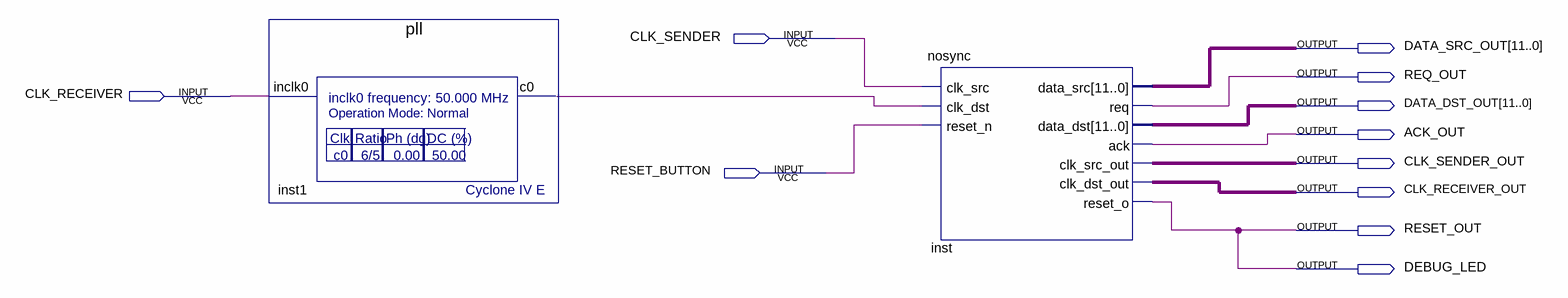
[diagram p0: schematic sheet]
// Quartus schematic no-sync_Top.bdf as structural Verilog: 2 symbols, 11 pins
module \no-sync_Top  (
  input  CLK_SENDER,
  input  CLK_RECEIVER,
  input  RESET_BUTTON,
  output [11:0] DATA_SRC_OUT,
  output REQ_OUT,
  output [11:0] DATA_DST_OUT,
  output ACK_OUT,
  output CLK_SENDER_OUT,
  output CLK_RECEIVER_OUT,
  output RESET_OUT,
  output DEBUG_LED
);

  wire inst1_c0;

  pll inst1 (.inclk0(CLK_RECEIVER), .c0(inst1_c0));
  nosync inst (
    .clk_src(CLK_SENDER), .clk_dst(inst1_c0), .reset_n(RESET_BUTTON), .data_src(DATA_SRC_OUT), .req(REQ_OUT),
    .data_dst(DATA_DST_OUT), .ack(ACK_OUT), .clk_src_out(CLK_SENDER_OUT), .clk_dst_out(CLK_RECEIVER_OUT),
    .reset_o(DEBUG_LED));

  assign RESET_OUT = DEBUG_LED;
endmodule
